# Altium schematic sheet LDO.SchDoc
size OrCAD E
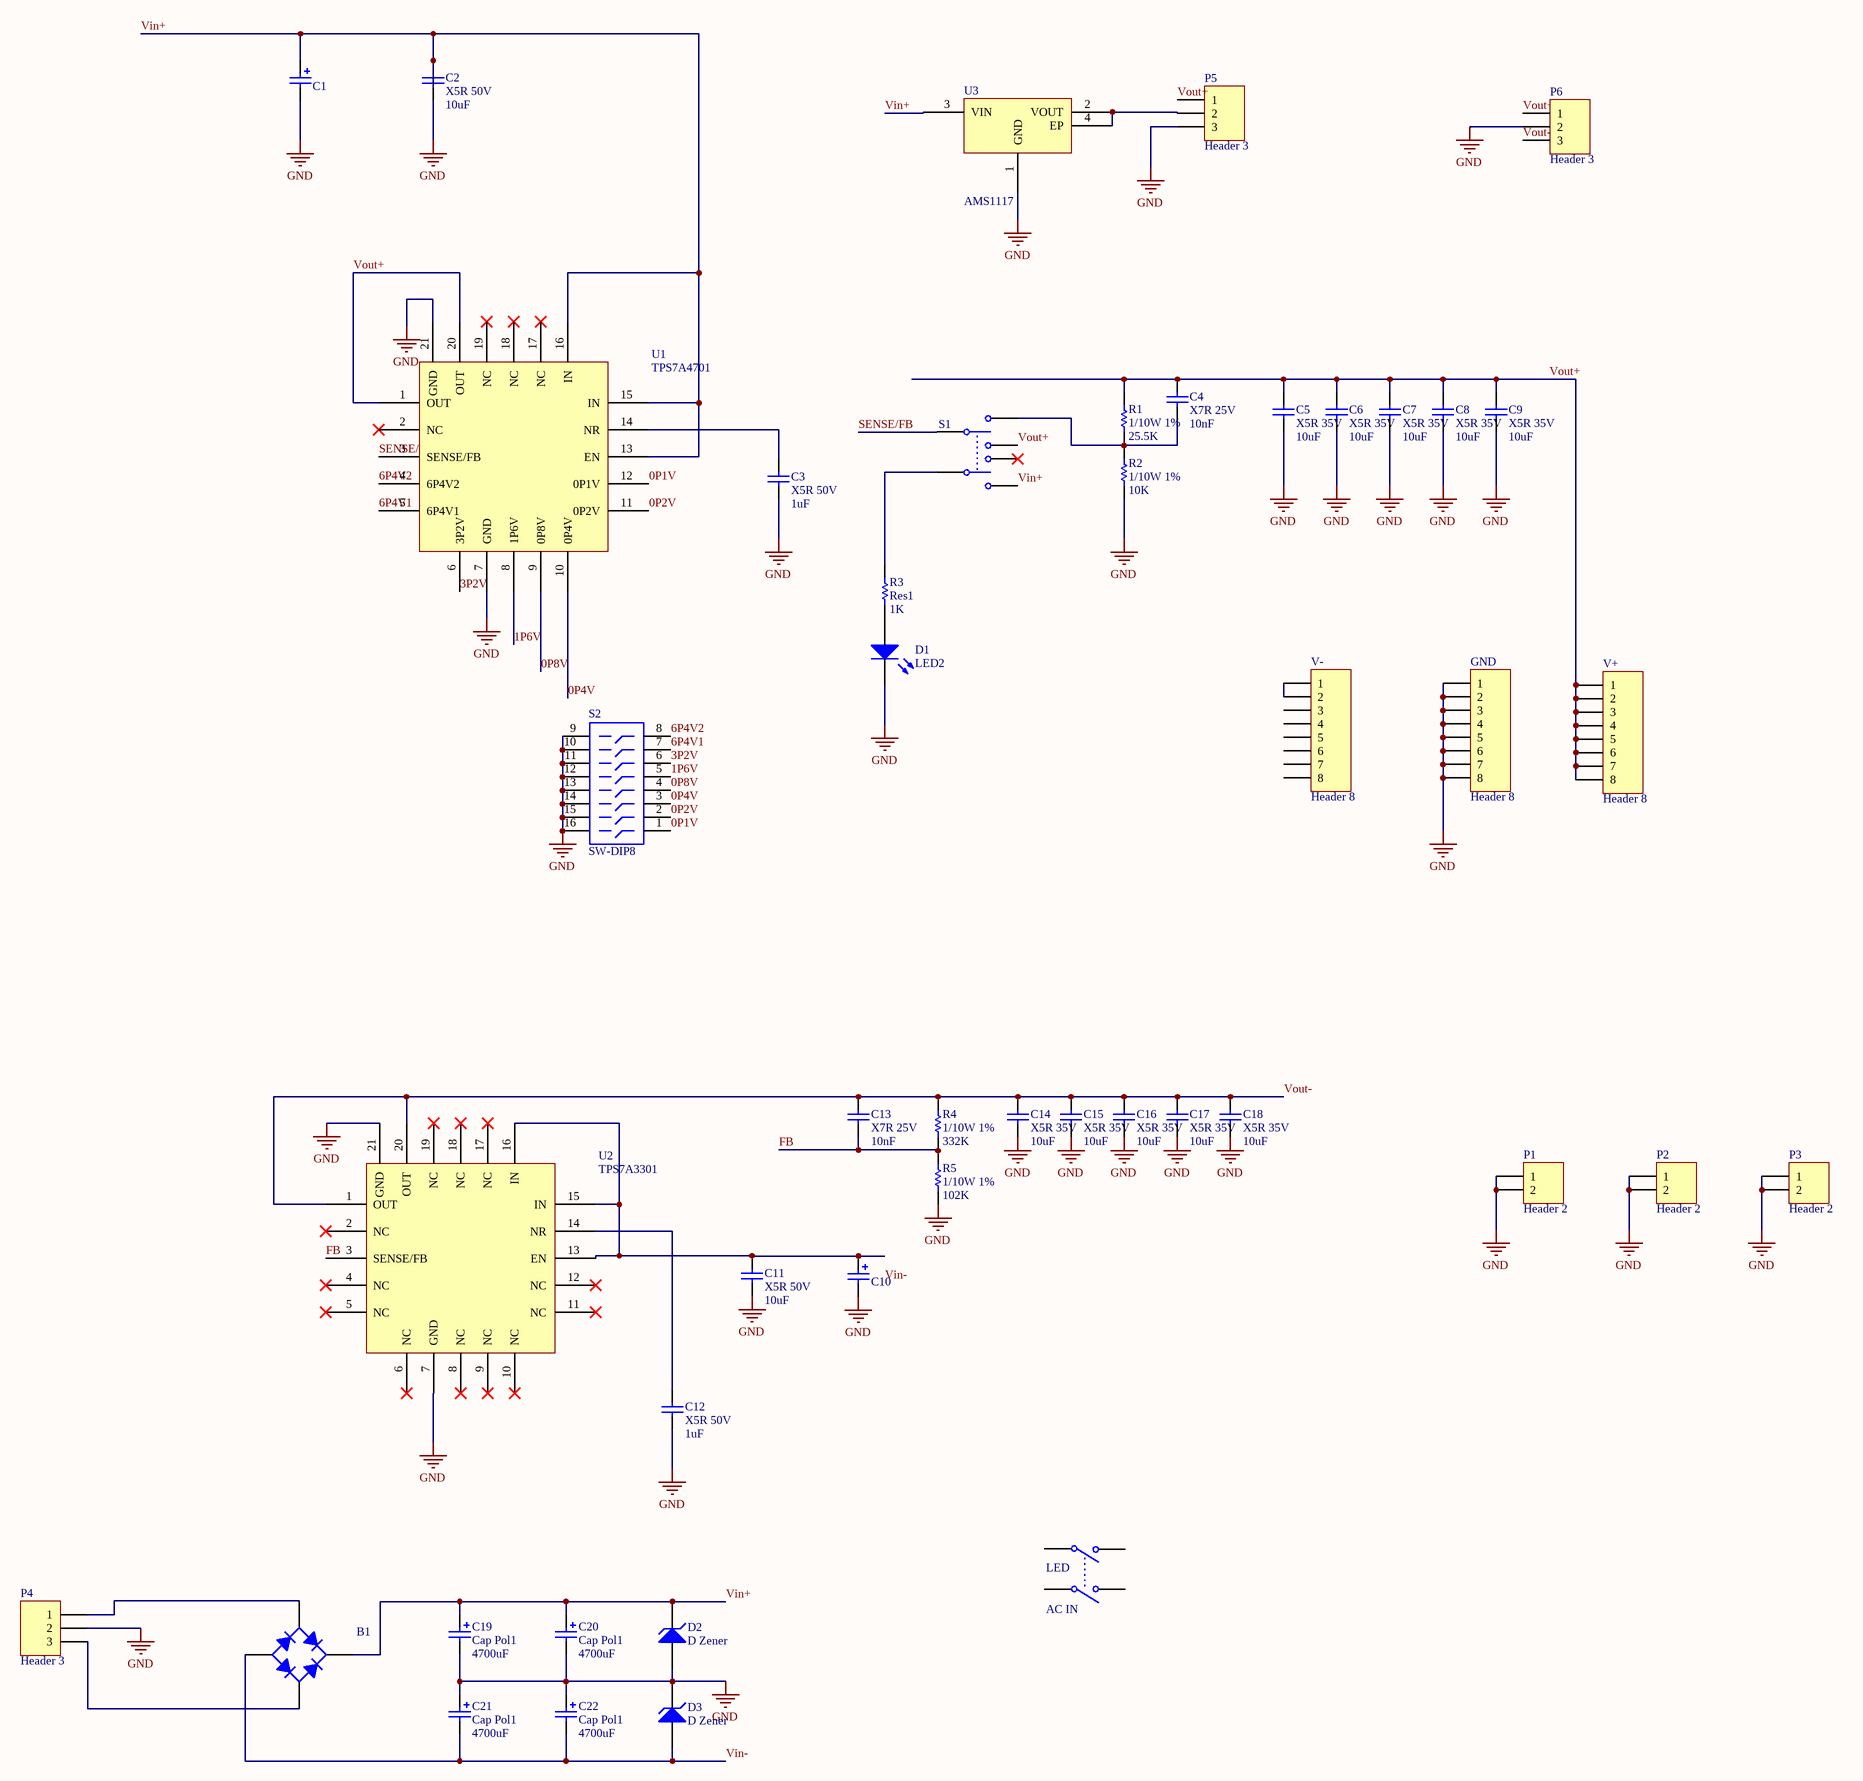
[diagram p0: LDO.SchDoc]

## Parts
AC_IN  SW AC 250V 6A  [SW AC 250V 6A]  (value not drawn)
B1  Diode Bridge  [Diode Bridge]  (value not drawn)
C1  Tantalum  [D 7343-31]  (value not drawn)
C2  X5R 50V  value 10uF  [C1206]
C3  X5R 50V  value 1uF  [1608[0603]]
C4  X7R 25V  value 10nF  [1608[0603]]
C5  X5R 35V  value 10uF  [6-0805_N]
C6  X5R 35V  value 10uF  [6-0805_N]
C7  X5R 35V  value 10uF  [6-0805_N]
C8  X5R 35V  value 10uF  [6-0805_N]
C9  X5R 35V  value 10uF  [6-0805_N]
C10  Tantalum  [D 7343-31]  (value not drawn)
C11  X5R 50V  value 10uF  [C1206]
C12  X5R 50V  value 1uF  [1608[0603]]
C13  X7R 25V  value 10nF  [1608[0603]]
C14  X5R 35V  value 10uF  [6-0805_N]
C15  X5R 35V  value 10uF  [6-0805_N]
C16  X5R 35V  value 10uF  [6-0805_N]
C17  X5R 35V  value 10uF  [6-0805_N]
C18  X5R 35V  value 10uF  [6-0805_N]
C19  Cap Pol1  value 4700uF  [RB7.6-15]
C20  Cap Pol1  value 4700uF  [RB7.6-15]
C21  Cap Pol1  value 4700uF  [RB7.6-15]
C22  Cap Pol1  value 4700uF  [RB7.6-15]
D1  LED2  [6-0805_N]
D2  D Zener  [AXIAL-0.3]
D3  D Zener  [AXIAL-0.3]
GND  Header 8  [HDR1X8]
P1  Header 2  [HDR1X2]
P2  Header 2  [HDR1X2]
P3  Header 2  [HDR1X2]
P4  Header 3  [HDR1X3]
P5  Header 3  [HDR1X3]
P6  Header 3  [HDR1X3]
R1  1/10W 1%  value 25.5K  [1608[0603]]
R2  1/10W 1%  value 10K  [1608[0603]]
R3  Res1  value 1K  [6-0805_N]
R4  1/10W 1%  value 332K  [1608[0603]]
R5  1/10W 1%  value 102K  [1608[0603]]
S1  SW  Press  [SW Press]  (value not drawn)
S2  SW-DIP8  [DIP-16-KEY]
U1  TPS7A4701  [RGW 5×5 QFN-20]
U2  TPS7A3301  [RGW 5×5 QFN-20]
U3  AMS1117  [SOT223_N]
V+  Header 8  [HDR1X8]
V-  Header 8  [HDR1X8]

## Nets
GND: C1.2 C2.1 C3.1 C5.1 C6.1 C7.1 C8.1 C9.1 C10.2 C11.1 C12.1 C14.1 C15.1 C16.1 C17.1 C18.1 C19.2 C20.2 C21.1 C22.1 D1.2(K) D2.1(A) D3.2(K) GND.1 GND.2 GND.3 GND.4 GND.5 GND.6 GND.7 GND.8 P1.1 P1.2 P2.1 P2.2 P3.1 P3.2 P4.2 P5.3 P6.2 R2.1 R5.1 S2.9 S2.10 S2.11 S2.12 S2.13 S2.14 S2.15 S2.16 U1.7(GND) U1.21(GND) U2.7(GND) U2.21(GND) U3.1(GND)
0P1V: S2.1 U1.12(0P1V)
0P2V: S2.2 U1.11(0P2V)
0P4V: S2.3 U1.10(0P4V)
0P8V: S2.4 U1.9(0P8V)
1P6V: S2.5 U1.8(1P6V)
3P2V: S2.6 U1.6(3P2V)
6P4V1: S2.7 U1.5(6P4V1)
6P4V2: S2.8 U1.4(6P4V2)
FB: C13.1 R4.1 R5.2 U2.3(SENSE/FB)
SENSE/FB: S1.3 U1.3(SENSE/FB)
Vin+: B1.4 C1.1 C2.2 C19.1 C20.1 D2.2(K) S1.5 U1.13(EN) U1.15(IN) U1.16(IN) U3.3(VIN)
Vin-: B1.1 C21.2 C22.2 D3.1(A)
Vout+: C4.2 C5.2 C6.2 C7.2 C8.2 C9.2 P5.1 P6.1 R1.2 S1.2 U1.1(OUT) U1.20(OUT) V+.1 V+.2 V+.3 V+.4 V+.5 V+.6 V+.7 V+.8
Vout-: C13.2 C14.2 C15.2 C16.2 C17.2 C18.2 P6.3 R4.2 U2.1(OUT) U2.20(OUT)
NetB1_2: B1.2 P4.1
NetB1_3: B1.3 P4.3
NetC3_2: C3.2 U1.14(NR)
NetC4_1: C4.1 R1.1 R2.2 S1.1
NetC10_1: C10.1 C11.2 U2.13(EN) U2.15(IN) U2.16(IN)
NetC12_2: C12.2 U2.14(NR)
NetD1_1: D1.1(A) R3.1
NetP5_2: P5.2 U3.2(VOUT) U3.4(EP)
NetR3_2: R3.2 S1.6
NetV-_1: V-.1 V-.2

Not connected (* = marked no-connect by the designer): AC_IN 1 2 3 4; S1 4*; U1 2(NC)* 17(NC)* 18(NC)* 19(NC)*; U2 2(NC)* 4(NC)* 5(NC)* 6(NC)* 8(NC)* 9(NC)* 10(NC)* 11(NC)* 12(NC)* 17(NC)* 18(NC)* 19(NC)*; V- 3 4 5 6 7 8

## Notes on the sheet
- Labels drawn without touching a wire or pin: Vin-
- (in symbol SW AC 250V 6A) LED

## Library data of the parts
C2 C11 = Cap Semi: Capacitor (Semiconductor SIM Model); Published: 8-Jun-2000; LatestRevisionDate: 29-May-2009; LatestRevisionNote: IPC-7351 Footprint Added.; PackageReference: C1206; Publisher: Altium Limited; PackageDescription: Chip Capacitor
C3-C9 C12-C18 = Cap: Capacitor; Published: 8-Jun-2000; LatestRevisionDate: 17-Jul-2002; LatestRevisionNote: Re-released for DXP Platform.; PackageReference: RAD-0.3; Publisher: Altium Limited; PackageDescription: Radial Cap, Thru-Hole; 2 Leads; 0.3 in Pin Spacing
C19-C22 = Cap Pol1: Polarized Capacitor (Radial); Published: 8-Jun-2000; LatestRevisionDate: 17-Jul-2002; LatestRevisionNote: Re-released for DXP Platform.; PackageReference: RB7.6-15; Publisher: Altium Limited; PackageDescription: Polarized Capacitor (Radial); 2 Leads
D1 = LED2: Typical RED, GREEN, YELLOW, AMBER GaAs LED; Published: 8-Jun-2000; LatestRevisionDate: 17-Jul-2002; LatestRevisionNote: Re-released for DXP Platform.; PackageVersion: Feb-2002; PackageReference: 3.2X1.6X1.1; Publisher: Altium Limited; PackageDescription: SM LED; 2 Flat Leads
D2 D3 = D Zener: Zener Diode; Published: 8-Jun-2000; LatestRevisionDate: 17-Jul-2002; LatestRevisionNote: Re-released for DXP Platform.; PackageReference: DIODE-0.7; Publisher: Altium Limited; PackageDescription: Diode, Thru-Hole; 2 Leads; 0.7 in Pin Spacing
GND V+ V- = Header 8: Header, 8-Pin; LatestRevisionDate: 17-Jul-2002; LatestRevisionNote: Re-released for DXP Platform.; Publisher: Altium Limited
P1-P3 = Header 2: Header, 2-Pin; LatestRevisionDate: 17-Jul-2002; LatestRevisionNote: Re-released for DXP Platform.; Publisher: Altium Limited
P4-P6 = Header 3: Header, 3-Pin; LatestRevisionDate: 17-Jul-2002; LatestRevisionNote: Re-released for DXP Platform.; Publisher: Altium Limited
R1-R5 = Res1: Resistor; Published: 8-Jun-2000; LatestRevisionDate: 17-Jul-2002; LatestRevisionNote: Re-released for DXP Platform.; PackageReference: AXIAL-0.3; Publisher: Altium Limited; PackageDescription: Axial Device, Thru-Hole; 2 Leads; 0.3 in Pin Spacing
S2 = SW-DIP8: 4009 Series DIP Switch, Raised actuator; Published: 24-Mar-1999; LatestRevisionDate: 17-Dec-2003; LatestRevisionNote: PCB Footprint replaced.; PackageReference: DIP-16-KEY; Publisher: Altium Limited; PackageDescription: DIP; 16 Leads; Row Spacing 7.62 mm; Pitch 2.54 mm; ComponentLink1Description: Manufacturer Link; ComponentLink1URL: http://www.oupiin.com/prodindx.html#Headers
U1 = TPS7A4701RGWT
U2 = TPS7A3301RGWT